# Altium schematic sheet cs301_Group2.SchDoc
size A4; SheetNumber: 1; SheetTotal: 3
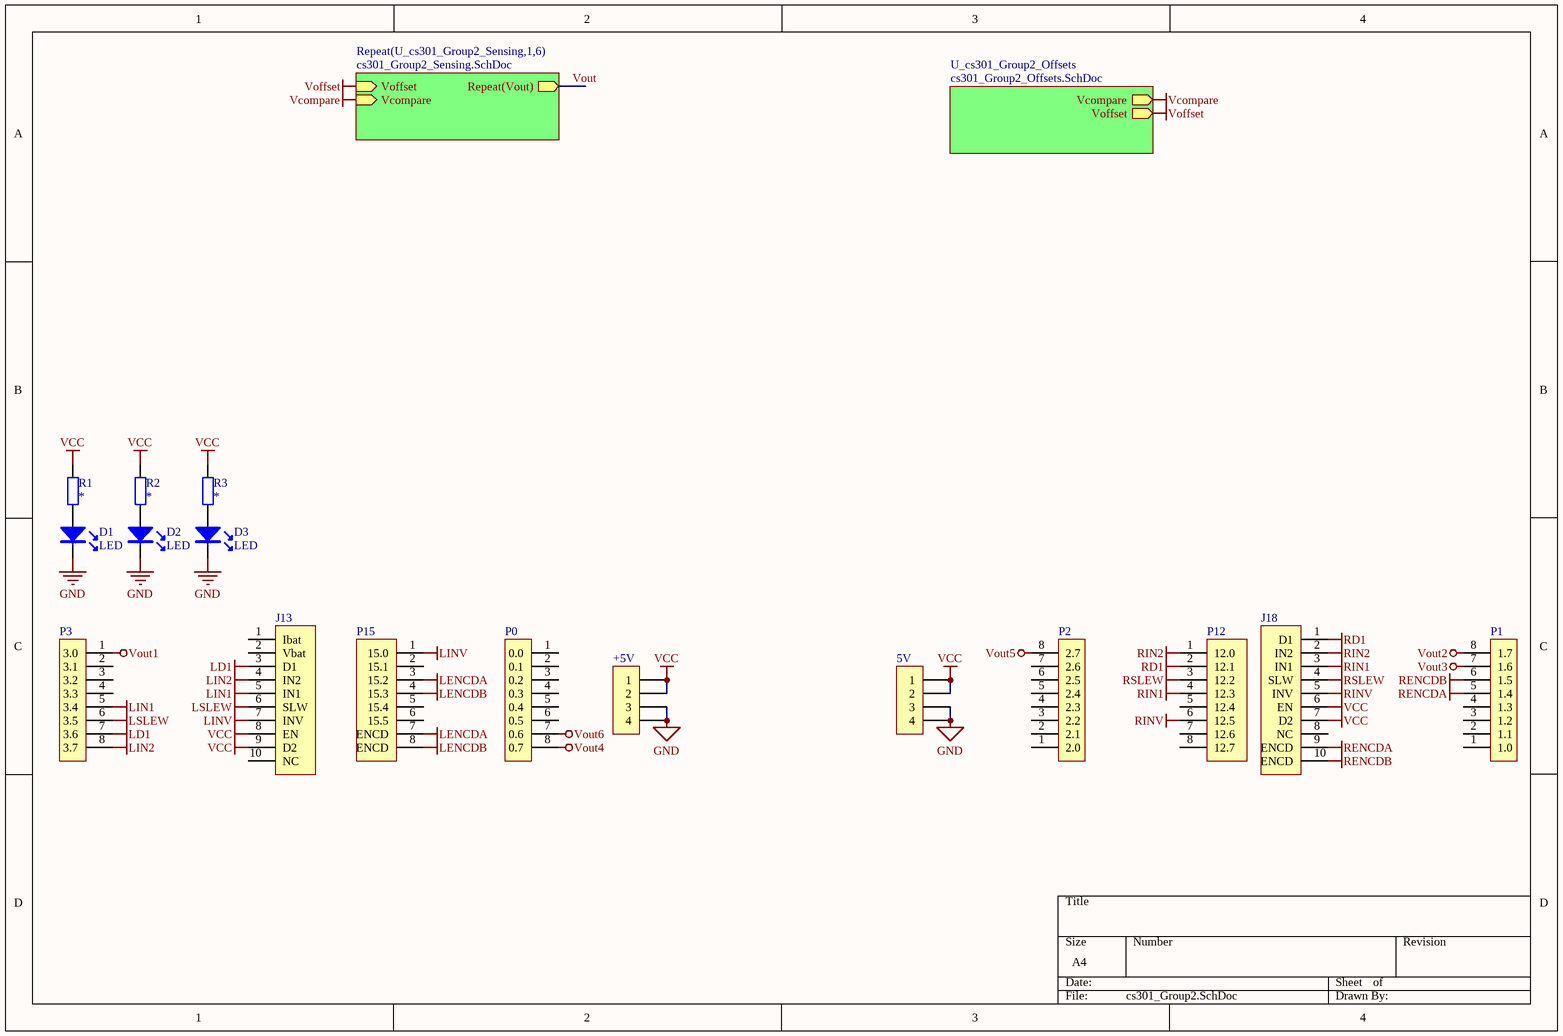
[diagram p0: cs301_Group2.SchDoc]

## Parts
5V  5V  [IDC4]  (value not drawn)
+5V  5V  [IDC4]  (value not drawn)
D1  LED  [LED0.1/5MM]
D2  LED  [LED0.1/5MM]
D3  LED  [LED0.1/5MM]
J13  CON10  [idc10]  (value not drawn)
J18  CON10  [IDC10]  (value not drawn)
P0  P0  [idc8]  (value not drawn)
P1  P1  [idc8]  (value not drawn)
P2  P2  [idc8]  (value not drawn)
P3  P3  [idc8]  (value not drawn)
P12  P12  [idc8]  (value not drawn)
P15  P15  [idc8]  (value not drawn)
R1  *  [0805 RES]
R2  *  [0805 RES]
R3  *  [0805 RES]

## Sub-sheets
Repeat(U_cs301_Group2_Sensing,1,6) = cs301_Group2_Sensing.SchDoc: Voffset (in), Vcompare (in), Repeat(Vout) (out)
U_cs301_Group2_Offsets = cs301_Group2_Offsets.SchDoc: Vcompare (out), Voffset (out)

## Nets
GND: 5V.3 5V.4 +5V.3 +5V.4 D1.K D2.K D3.K
LD1: J13.3(D1) P3.7(3.6)
LENCDA: P15.3(15.2) P15.7(ENCD)
LENCDB: P15.4(15.3) P15.8(ENCD)
LIN1: J13.5(IN1) P3.5(3.4)
LIN2: J13.4(IN2) P3.8(3.7)
LINV: J13.7(INV) P15.1(15.0)
LSLEW: J13.6(SLW) P3.6(3.5)
RD1: J18.1(D1) P12.2(12.1)
RENCDA: J18.9(ENCD) P1.5(1.4)
RENCDB: J18.10(ENCD) P1.6(1.5)
RIN1: J18.3(IN1) P12.4(12.3)
RIN2: J18.2(IN2) P12.1(12.0)
RINV: J18.5(INV) P12.6(12.5)
RSLEW: J18.4(SLW) P12.3(12.2)
VCC: 5V.1 5V.2 +5V.1 +5V.2 J13.8(EN) J13.9(D2) J18.6(EN) J18.7(D2) R1.2 R2.2 R3.2
Vcompare: sheet Repeat(U_cs301_Group2_Sensing,1,6)/Vcompare, sheet U_cs301_Group2_Offsets/Vcompare
Voffset: sheet Repeat(U_cs301_Group2_Sensing,1,6)/Voffset, sheet U_cs301_Group2_Offsets/Voffset
Vout1: P3.1(3.0)
Vout2: P1.8(1.7)
Vout3: P1.7(1.6)
Vout4: P0.8(0.7)
Vout5: P2.8(2.7)
Vout6: P0.7(0.6)
Vout: sheet Repeat(U_cs301_Group2_Sensing,1,6)/Repeat(Vout)
NetD1_A: D1.A R1.1
NetD2_A: D2.A R2.1
NetD3_A: D3.A R3.1

Not connected (* = marked no-connect by the designer): J13 1(Ibat) 2(Vbat) 10(NC); J18 8(NC); P0 1(0.0) 2(0.1) 3(0.2) 4(0.3) 5(0.4) 6(0.5); P1 1(1.0) 2(1.1) 3(1.2) 4(1.3); P2 1(2.0) 2(2.1) 3(2.2) 4(2.3) 5(2.4) 6(2.5) 7(2.6); P3 2(3.1) 3(3.2) 4(3.3); P12 5(12.4) 7(12.6) 8(12.7); P15 2(15.1) 5(15.4) 6(15.5)

## Library data of the parts
5V +5V = CON4: Connector
J13 J18 = CON10: Connector
P0-P3 = CON8: Connector
P12 P15 = CON8_1: Connector
R1-R3 = Res_SMT_0805: 0805 resistor; Published: 8-Jun-2000; LatestRevisionDate: 17-Jul-2002; LatestRevisionNote: Re-released for DXP Platform.; PackageReference: AXIAL-0.4; Publisher: Altium Limited; Value: *; ComponentLink1Description: https://nz.mouser.com/datasheet/2/315/AOA0000C304-1149620.pdf